# EAGLE schematic DB (EAGLE 9.6.1)
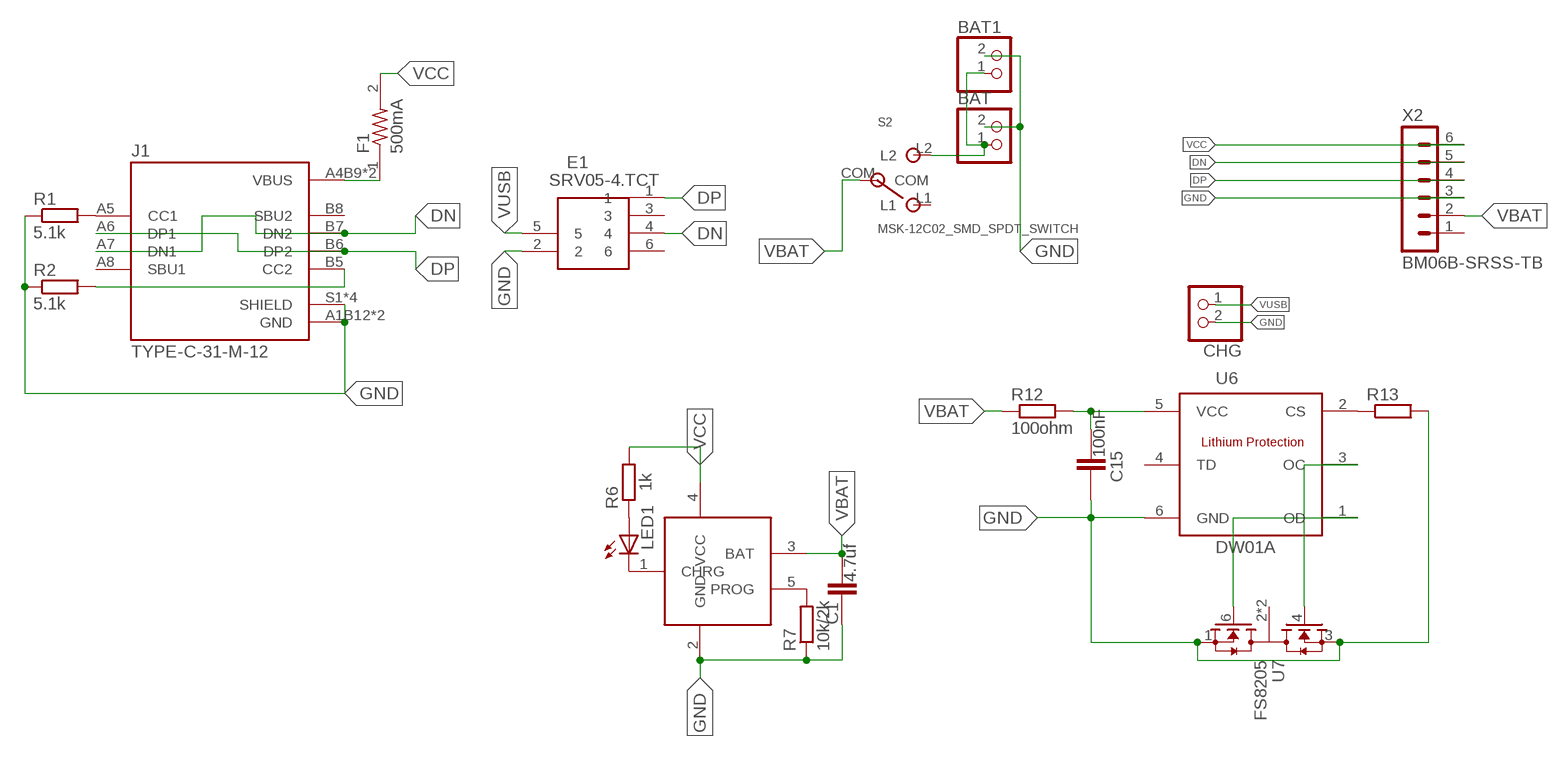
[diagram p0: schematic, sheet 1]

## Parts
BAT  JST_2PIN-THM-RA  [JST-PH-2-THM-RA]
BAT1  JST_2PIN-THM-RA  [JST-PH-2-THM-RA]
C1  4.7uf  CAPACITOR-C0805  [C0805]
C15  100nF  CAPACITOR-C0805  [C0805]
CHG  JST_2PIN-THM-RA  [JST-PH-2-THM-RA]
E1  SRV05-4.TCT  [SOT95P280X145-6N]
F1  500mA  0ZCJ0075AF2E  [RESC3216X125N]
J1  TYPE-C-31-M-12  [HRO_TYPE-C-31-M-12]
LED1  LEDCHIPLED_1206  [CHIPLED_1206]
R1  5.1k  RESISTOR-0805  [R0805]
R2  5.1k  RESISTOR-0805  [R0805]
R6  1k  RESISTOR-0805  [R0805]
R7  10k/2k  RESISTOR-0805  [R0805]
R12  100ohm  RESISTOR-0805  [R0805]
R13  RESISTOR-0805  [R0805]
S2  MSK-12C02_SMD_SPDT_SWITCH  [MSK-12C02]
U3  LTC4054  [LTC4054]
U6  DW01A  [SOT23-6]
U7  FS8205  [SOT95P280X145-6N]
X2  BM06B-SRSS-TB  [BM06B-SRSS-TB]

## Nets
DN: E1.4 J1.A7(DN1) J1.B7(DN2) X2.5
DP: E1.1 J1.A6(DP1) J1.B6(DP2) X2.4
GND: BAT1.2 BAT.2 C1.1 C15.1 CHG.2 E1.2 J1.A1B12(GND) J1.B1A12(GND) J1.S1(SHIELD) J1.S2(SHIELD) J1.S3(SHIELD) J1.S4(SHIELD) R1.1 R2.1 R7.1 R13.2 U3.2(GND) U6.6(GND) U7.1(S1) U7.3(S2) X2.3
N$82: BAT1.1 BAT.1 S2.L2
N$83: J1.A5(CC1) R1.2
N$85: J1.B5(CC2) R2.2
N$87: R7.2 U3.5(PROG)
N$88: LED1.C U3.1(CHRG)
N$89: LED1.A R6.1
N$110: C15.2 R12.2 U6.5(VCC)
N$111: R13.1 U6.2(CS)
N$112: U6.1(OD) U7.6(G1)
N$113: U6.3(OC) U7.4(G2)
VBAT: C1.2 R12.1 S2.COM U3.3(BAT) X2.2
VCC: F1.2 R6.2 U3.4(VCC) X2.6
VUSB: CHG.1 E1.5 F1.1 J1.A4B9(VBUS) J1.B4A9(VBUS)
Unconnected: E1.3 E1.6 J1.A8(SBU1) J1.B8(SBU2) S2.L1 U6.4(TD) U7.2(D12) U7.5(D12) X2.1

## Library data of the parts
BAT BAT1 CHG = adafruit:JST_2PIN: JST 2-Pin Connectors of various flavors SMT-RA (S2B-PH-SM4) 4UConnector #17311 SMT (B2B-PH-SM4) THM-RA (S2B-PH) THM (B2B-PH)
C1 C15 = Components:CAPACITOR
E1 = SRV05-4.TCT:SRV05-4.TCT: Semtech SRV05-4.TCT, Uni-Directional TVS Diode Array, 300W, 6-Pin SOT-23 Source: Datasheet <https://componentsearchengine.com/Datasheets/1/SRV05-4.TCT.pdf> Check prices <https://pricing.snapeda.com/parts/SRV05-4.TC/Semtech/view-part?ref=eda>; AVAILABILITY: In Stock; DESCRIPTION: 17.5V Clamp 12A (8/20µs) Ipp Tvs Diode Surface Mount SOT-23-6; MF: Semtech; MP: SRV05-4.TC; PACKAGE: SOT-23-6 Semtech; PRICE: None; PURCHASE-URL: https://pricing.snapeda.com/search/part/SRV05-4.TC/?ref=eda
F1 = fuse:0ZCJ0075AF2E: PTC RESTTBLE 0.75A 16V CHIP 1206 Check prices <https://pricing.snapeda.com/parts/0ZCJ0075AF2E/Bel%20Fuse/view-part?ref=eda>; AVAILABILITY: In Stock; DESCRIPTION: 1206 SMT PPTC | 0.75 Ih | 16V; MF: Bel Fuse; MP: 0ZCJ0075AF2E; PACKAGE: 1206 Bel Fuse; PRICE: None; PURCHASE-URL: https://pricing.snapeda.com/search/part/0ZCJ0075AF2E/?ref=eda
J1 = TYPE-C-31-M-12:TYPE-C-31-M-12: USB Connectors 24 Receptacle 1 8.94*7.3mm RoHS; AVAILABILITY: Unavailable; DESCRIPTION: USB Connectors 24 Receptacle 1 8.94*7.3mm RoHS; MF: HRO Electronics Co., Ltd.; MP: TYPE-C-31-M-12; PACKAGE: Package; PRICE: None
LED1 = adafruit:LED: LED OSRAM: - CHIPLED LG R971, LG N971, LY N971, LG Q971, LY Q971, LO R971, LY R971 LH N974, LH R974 LS Q976, LO Q976, LY Q976 LO Q996 - Hyper CHIPLED LW Q18S LB Q993, LB Q99A, LB R99A - SideLED LS A670, LO A670, LY A670, LG A670, LP A670 LB A673, LV A673, LT A673, LW A673 LH A674 LY A675 LS A676, LA A676, LO A676, LY A676, LW A676 LS A679, LY A679, LG A679 - Hyper Micro SIDELED® LS Y876, LA Y876, LO Y876, LY Y876 LT Y87S - SmartLED LW L88C, LW L88S LB L89C, LB L89S, LG L890 LS L89K, LO L89K, LY L89K LS L896, LA L896, LO L896, LY L896 - TOPLED LS T670, LO T670, LY T670, LG T670, LP T670 LSG T670, LSP T670, LSY T670, LOP T670, LYG T670 LG T671, LOG T671, LSG T671 LB T673, LV T673, LT T673, LW T673 LH T674 LS T676, LA T676, LO T676, LY T676, LB T676, LH T676, LSB T676, LW T676 LB T67C, LV T67C, LT T67C, LS T67K, LO T67K, LY T67K, LW E67C LS E67B, LA E67B, LO E67B, LY E67B, LB E67C, LV E67C, LT E67C LW T67C LS T679, LY T679, LG T679 LS T770, LO T770, LY T770, LG T770, LP T770 LB T773, LV T773, LT T773, LW T773 LH T774 LS E675, LA E675, LY E675, LS T675 LS T776, LA T776, LO T776, LY T776, LB T776 LHGB T686 LT T68C, LB T68C - Hyper Mini TOPLED® LB M676 - Mini TOPLED Santana® LG M470 LS M47K, LO M47K, LY M47K Source: http://www.osram.convergy.de/
R1 R2 R6 R7 R12 R13 = Components:RESISTOR
S2 = MSK-12C02 SMD Micro Slider Switch SPDT:MSK-12C02_SMD_SPDT_SWITCH: Footprint of the VIMEX MSK-12C02 SPDT SMD Switch Created by mzst on 17-Jan-2016
U3 = LTC4054:LTC4054: LTC4054 Li-ion Charger IC TSOT 5
U6 = DW01A:DW01A: Check availability <https://pricing.snapeda.com/parts/DW01A/Fortune%20Semiconductor/view-part?ref=eda>; AVAILABILITY: Not in stock; DESCRIPTION: One Cell Lithium-ion/Polymer Battery Protection IC; MF: Fortune Semiconductor; MP: DW01A; PACKAGE: SOT-23-6 Fortune Semiconductor; PRICE: None
U7 = FS8205:FS8205: Dual N Channel Enhancement Mode Power MOSFET Check availability <https://pricing.snapeda.com/parts/FS8205/Fortune%20Semiconductor/view-part?ref=eda>; AVAILABILITY: Not in stock; DESCRIPTION: Dual N-Channel Enhancement Mode Power MOSFET; MF: Fortune Semiconductor; MP: FS8205; PACKAGE: Package; PRICE: None
X2 = con-JST SH:BM06B-SRSS: JST SH series header 1.00mm pitch disconnectable crimp style connectors, vertical (side entry type), 6 pins